# EAGLE design Pot (EAGLE 6.5.0)
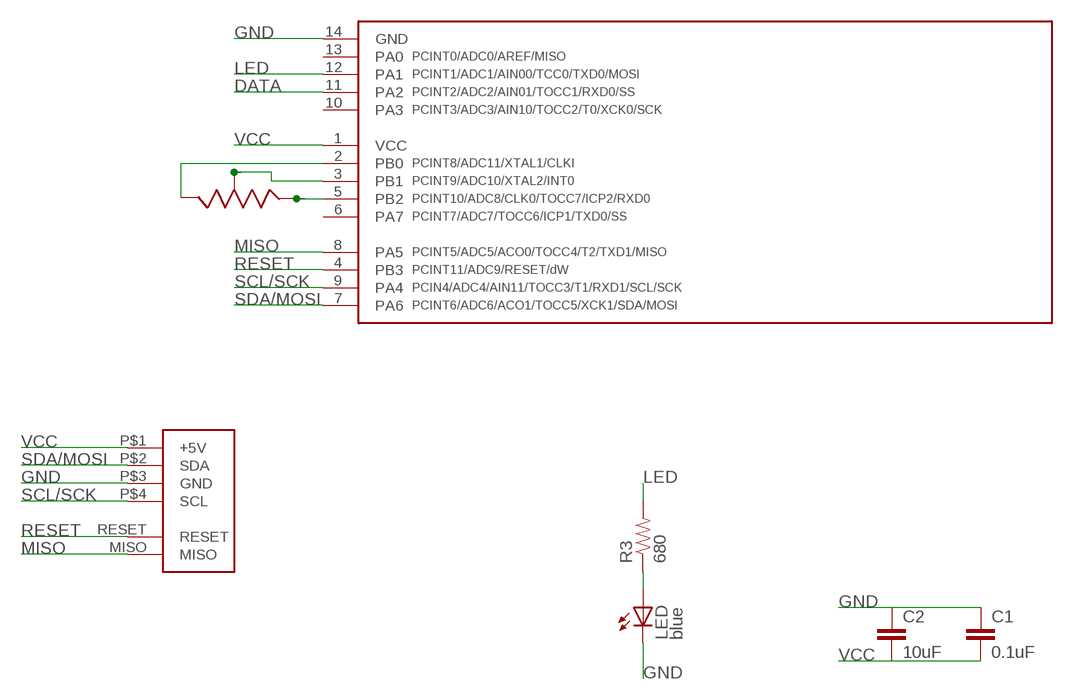
[diagram p0: schematic, sheet 1]

## Parts
C1  0.1uF  CAP0805  [0805]
C2  10uF  CAP0805  [0805]
LED  blue  LEDCHIPLED_1206  [CHIPLED_1206]
R3  680  RESISTOR0805-RES  [0805]
U$2  BOURNS_PRS11S  [PRS11S]
U$3  TINY841  [SOIC14]
U$4  FOOTPRINT  [FOOTPRINT]

## Nets
DATA: U$3.11(PA2)
GND: C1.1 C2.1 LED.C U$3.14(GND) U$4.P$3(GND)
LED: R3.2 U$3.12(PA1)
MISO: U$3.8(PA5) U$4.MISO
N$2: U$2.2(P1) U$3.5(PB2)
N$3: U$2.3(P2) U$3.3(PB1)
N$4: U$2.1(P3) U$3.2(PB0)
N$5: LED.A R3.1
RESET: U$3.4(PB3) U$4.RESET
SCL/SCK: U$3.9(PA4) U$4.P$4(SCL)
SDA/MOSI: U$3.7(PA6) U$4.P$2(SDA)
VCC: C1.2 C2.2 U$3.1(VCC) U$4.P$1(+5V)
Unconnected: U$3.6(PA7) U$3.10(PA3) U$3.13(PA0)

## Library data of the parts
C1 C2 = SparkFun-Capacitors:CAP: Capacitor Standard 0603 ceramic capacitor, and 0.1" leaded capacitor.
LED = led:LED: LED OSRAM: - CHIPLED LG R971, LG N971, LY N971, LG Q971, LY Q971, LO R971, LY R971 LH N974, LH R974 LS Q976, LO Q976, LY Q976 LO Q996 - Hyper CHIPLED LW Q18S LB Q993, LB Q99A, LB R99A - SideLED LS A670, LO A670, LY A670, LG A670, LP A670 LB A673, LV A673, LT A673, LW A673 LH A674 LY A675 LS A676, LA A676, LO A676, LY A676, LW A676 LS A679, LY A679, LG A679 - Hyper Micro SIDELED® LS Y876, LA Y876, LO Y876, LY Y876 LT Y87S - SmartLED LW L88C, LW L88S LB L89C, LB L89S, LG L890 LS L89K, LO L89K, LY L89K LS L896, LA L896, LO L896, LY L896 - TOPLED LS T670, LO T670, LY T670, LG T670, LP T670 LSG T670, LSP T670, LSY T670, LOP T670, LYG T670 LG T671, LOG T671, LSG T671 LB T673, LV T673, LT T673, LW T673 LH T674 LS T676, LA T676, LO T676, LY T676, LB T676, LH T676, LSB T676, LW T676 LB T67C, LV T67C, LT T67C, LS T67K, LO T67K, LY T67K, LW E67C LS E67B, LA E67B, LO E67B, LY E67B, LB E67C, LV E67C, LT E67C LW T67C LS T679, LY T679, LG T679 LS T770, LO T770, LY T770, LG T770, LP T770 LB T773, LV T773, LT T773, LW T773 LH T774 LS E675, LA E675, LY E675, LS T675 LS T776, LA T776, LO T776, LY T776, LB T776 LHGB T686 LT T68C, LB T68C - Hyper Mini TOPLED® LB M676 - Mini TOPLED Santana® LG M470 LS M47K, LO M47K, LY M47K Source: http://www.osram.convergy.de LUXEON: - LUMILED® LXK2-PW12-R00, LXK2-PW12-S00, LXK2-PW14-U00, LXK2-PW14-V00 LXK2-PM12-R00, LXK2-PM12-S00, LXK2-PM14-U00 LXK2-PE12-Q00, LXK2-PE12-R00, LXK2-PE12-S00, LXK2-PE14-T00, LXK2-PE14-U00 LXK2-PB12-K00, LXK2-PB12-L00, LXK2-PB12-M00, LXK2-PB14-N00, LXK2-PB14-P00, LXK2-PB14-Q00 LXK2-PR12-L00, LXK2-PR12-M00, LXK2-PR14-Q00, LXK2-PR14-R00 LXK2-PD12-Q00, LXK2-PD12-R00, LXK2-PD12-S00 LXK2-PH12-R00, LXK2-PH12-S00 LXK2-PL12-P00, LXK2-PL12-Q00, LXK2-PL12-R00 Source: www.luxeon.com KINGBRIGHT: KA-3528ASYC Source: www.kingbright.com
R3 = SparkFun-Passives:RESISTOR: Resistor Basic schematic elements and footprints for 0603, 1206, and PTH resistors.
U$2 = IntegerLabs:BOURNS_PRS11S
U$3 = IntegerLabs:TINY841
U$4 = IntegerLabs:FOOTPRINT

## Board
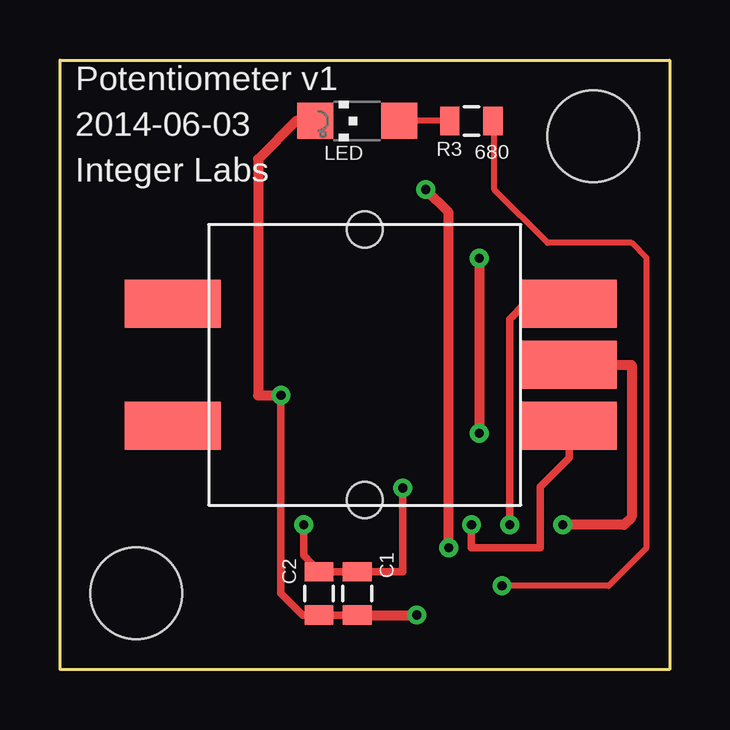
[diagram p1: board, top side]
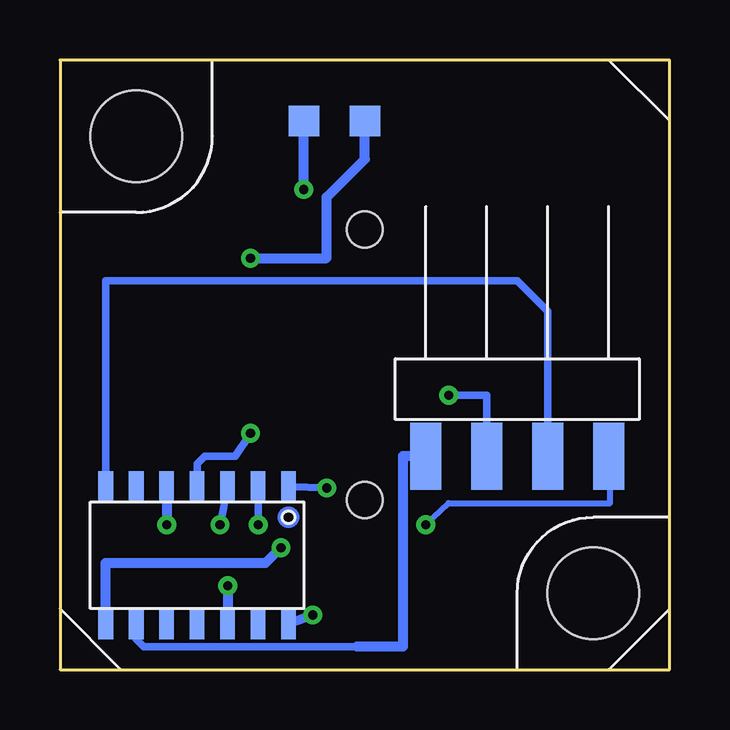
[diagram p2: board, bottom side, seen from below]

Size 25.4 x 25.4 mm. Coordinates in mm from the lower left corner, seen from the top.
Outline: 0,0 25.4,0 25.4,25.4 0,25.4 0,0
Copper layers (1*16): Top 0.0178mm / dielectric 59mil / Bottom 0.0178mm
Design rules "SSC-EAGLE-2Lyr_v1.0.0.3": minimum track width 6mil, minimum drill 14mil, track to track 6mil, track to pad 6mil, pad to pad 6mil, via to via 6mil, smd to smd 6mil, copper to edge 20mil, drill to drill 16mil, minimum pad ring 8mil, minimum via ring 8mil, stop-mask expansion 3mil, vias tented up to drill 0mil, thermal gap 10mil

### Footprints (pad centres in the part's own frame; a part is rotated, then mirrored left to right if it is on the bottom)
0805 = smd 0.8 x 1.2: 1 -0.9,0; 2 0.9,0
CHIPLED_1206 = smd 1.5 x 1.5: A 0,-1.75; C 0,1.75
PRS11S = smd 2.007 x 3.988: 1 -2.54,-8.509; 2 0,-8.509; 3 2.54,-8.509; NC1 -2.54,8.001; NC2 2.54,8.001 | hole 1.499: 5.639,0; -5.639,0
SOIC14 = smd 0.61 x 1.27: 1 0,-3.175; 2 1.27,-3.175; 3 2.54,-3.175; 4 3.81,-3.175; 5 5.08,-3.175; 6 6.35,-3.175; 7 7.62,-3.175; 8 7.62,2.54; 9 6.35,2.54; 10 5.08,2.54; 11 3.81,2.54; 12 2.54,2.54; 13 1.27,2.54; 14 0,2.54
FOOTPRINT = smd 1.27 x 1.27 bottom: MISO 15.24,22.86; RESET 12.7,22.86 | smd 1.295 x 2.794 bottom: P$1 2.54,8.89; P$2 5.08,8.89; P$3 7.62,8.89; P$4 10.16,8.89 | hole 3.81: 22.225,22.225; 3.175,3.175

### Placement (x,y rotation side)
C1  12.38,3.17 90 top
C2  10.79,3.17 90 top
LED  12.38,22.86 90 top
R3  17.14,22.86 0 top
U$2  12.7,12.7 90 top
U$3  15.88,4.45 180 bottom
U$4  0,0 0 top

### Tracks (layer width: path | path; a pad name or v marks a point on that pad's centre or on a via)
GND  (via drill 0.38)
  Top 0.305: C1.1 C2.1 10.11,2.27 9.21,3.17 v9.21,11.43
  Top 0.406: C1.1 v14.87,2.27 | LED.C 9.84,22.86 8.26,21.27 8.26,11.43 v9.21,11.43
  Bottom 0.305: v9.21,11.43 7.62,11.43 U$4.P$3
  Bottom 0.406: v14.87,2.27 U$3.14
LED  (via drill 0.38)
  Top 0.254: R3.2 18.1,22.81 18.1,20 20.32,17.78 23.81,17.78 24.45,17.14 24.45,5.08 22.86,3.49 v18.41,3.49
  Bottom 0.406: v18.41,3.49 U$3.12
MISO  (via drill 0.38)
  Top 0.406: v16.19,5.08 16.19,19.05 v15.24,20
  Bottom 0.406: U$3.8 23.5,4.45 16.83,4.45 v16.19,5.08 | v15.24,20 U$4.MISO
N$2  (via drill 0.38)
  Top 0.406: U$2.2 23.81,12.7 23.81,6.35 23.5,6.03 v20.95,6.03
  Bottom 0.406: U$3.5 v20.95,6.03
N$3  (via drill 0.38)
  Top 0.305: U$2.3 19.37,15.24 18.73,14.61 v18.73,6.03
  Bottom 0.305: U$3.3 v18.73,6.03
N$4  (via drill 0.38)
  Top 0.305: U$2.1 21.21,8.83 20,7.62 20,5.08 17.14,5.08 v17.14,6.03
  Bottom 0.305: U$3.2 v17.14,6.03
N$5
  Top 0.254: R3.1 LED.A
RESET  (via drill 0.38)
  Top 0.406: v17.46,17.14 v17.46,9.85
  Bottom 0.305: U$3.4 19.68,8.57 19.37,8.89 18.11,8.89 v17.46,9.85
  Bottom 0.406: v17.46,17.14 14.29,17.14 14.29,19.68 12.7,21.27 U$4.RESET
SCL/SCK
  Bottom 0.305: 13.02,0.95 21.91,0.95 22.23,1.27 U$3.9
  Bottom 0.406: U$4.P$4 11.11,8.89 11.11,0.95 13.02,0.95
SDA/MOSI
  Bottom 0.305: U$3.7 23.5,16.19 6.35,16.19 5.08,14.92 U$4.P$2
VCC  (via drill 0.38)
  Top 0.305: v14.29,7.57 14.29,4.08 C1.2 C2.2 10.16,4.76 v10.16,6.03
  Bottom 0.254: v10.16,6.03 9.21,6.93 2.48,6.93 2.48,8.51 U$4.P$1
  Bottom 0.305: U$3.1 v14.29,7.57
(copper drawn outside any net)
  shapes: Bottom circle x1

### Text on the board
tPlace: Potentiometer v1 | 2014-06-03 | Integer Labs